# EAGLE design Gripper Control Board (EAGLE 9.6.2)
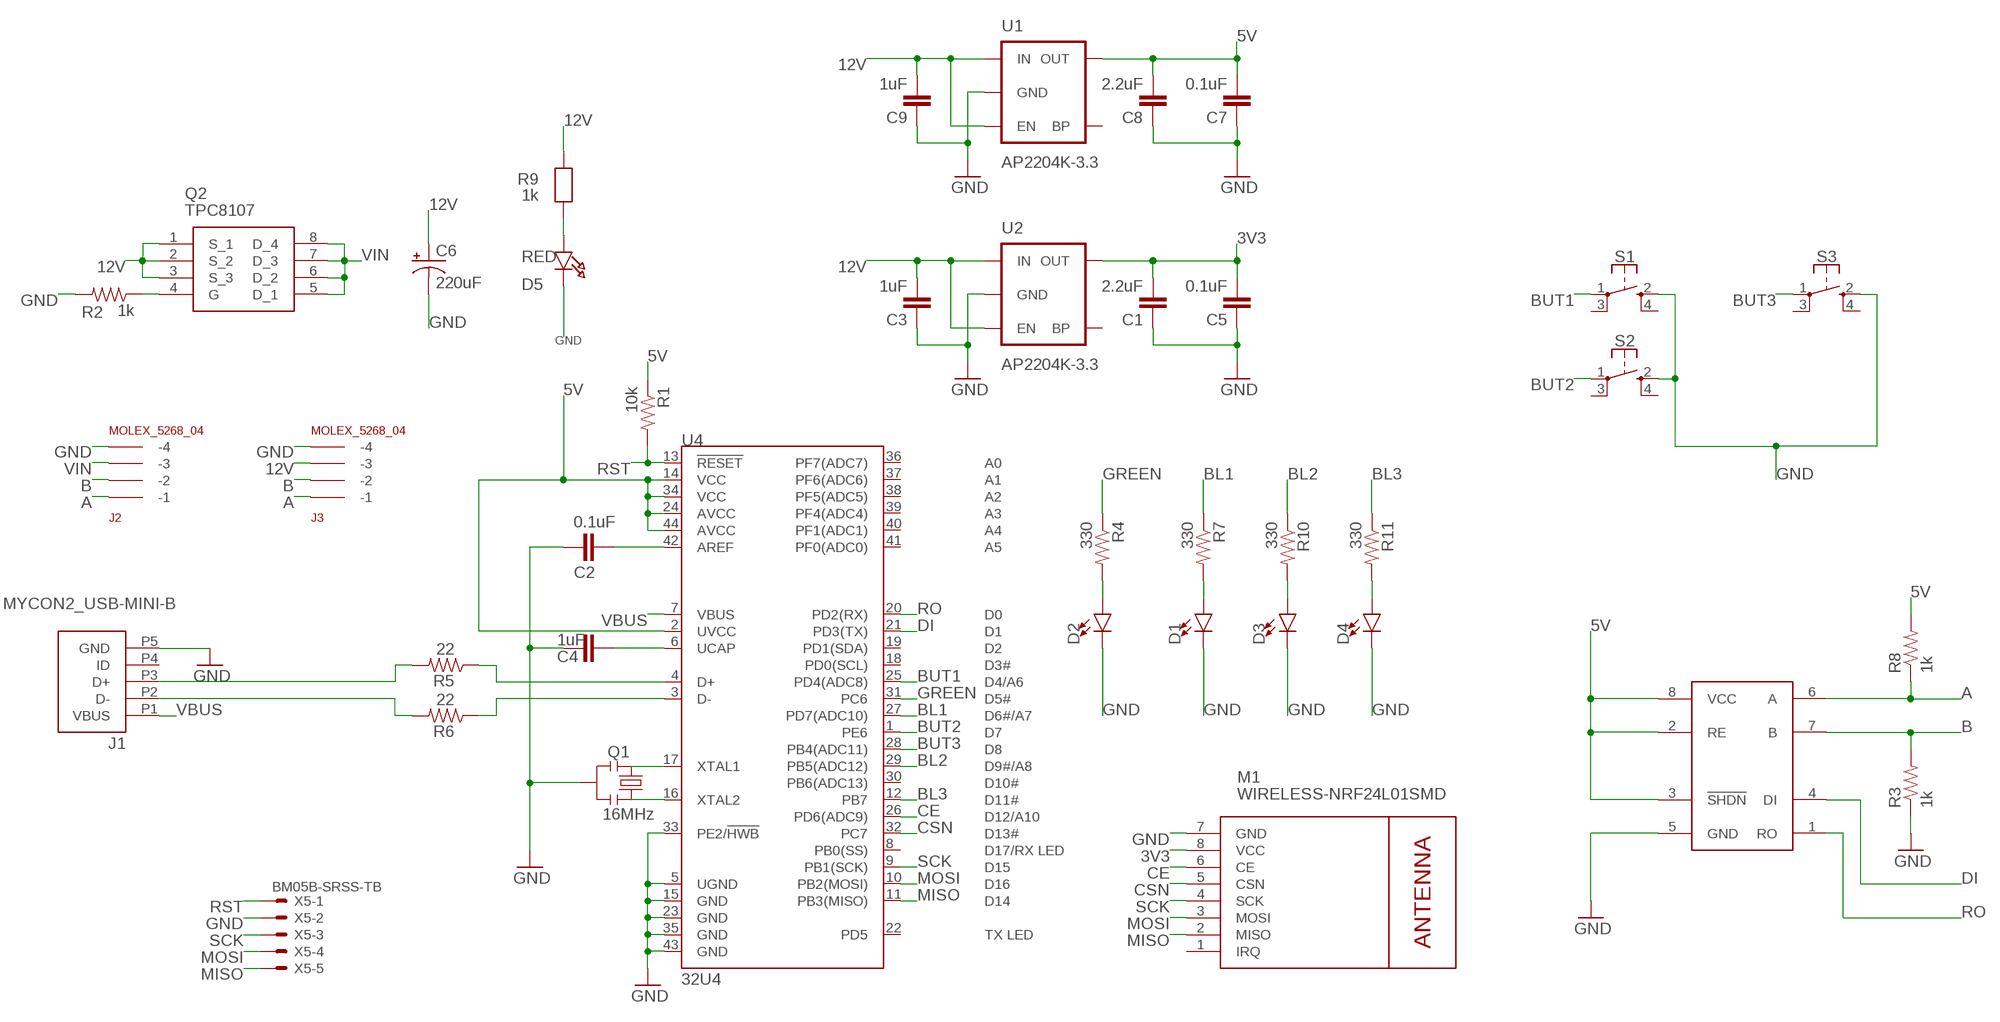
[diagram p0: schematic, sheet 1]

## Parts
C1  2.2uF  CAP0603-CAP  [0603-CAP]
C2  0.1uF  CAP0603-CAP  [0603-CAP]
C3  1uF  CAP0603-CAP  [0603-CAP]
C4  1uF  CAP0603-CAP  [0603-CAP]
C5  0.1uF  CAP0603-CAP  [0603-CAP]
C6  220uF  100UF-POLAR-25V-20%(ELEC)  [PANASONIC_D]
C7  0.1uF  CAP0603-CAP  [0603-CAP]
C8  2.2uF  CAP0603-CAP  [0603-CAP]
C9  1uF  CAP0603-CAP  [0603-CAP]
D1  LED0603  [LED-0603]
D2  LED0603  [LED-0603]
D3  LED0603  [LED-0603]
D4  LED0603  [LED-0603]
D5  RED  LED0603  [CHIPLED_0603]
J1  MYCON2_USB-MINI-B  [CON2_USB_MICRO_B_AT]
J2  MOLEX_5268_04  [5267-4]
J3  MOLEX_5268_04  [5267-4]
M1  WIRELESS-NRF24L01SMD  [WIRELESS-NRF24L01-SMD]
Q1  16MHz  RESONATORSMD  [RESONATOR-SMD]
Q2  TPC8107  [SOIC127P600X175-8N]
R1  10k  RESISTOR0603  [0603-RES]
R2  1k  1KOHM-0603-1/10W-1%  [0603]
R3  1k  RESISTOR0603-RES  [0603-RES]
R4  330  RESISTOR0603  [0603-RES]
R5  22  RESISTOR0603  [0603-RES]
R6  22  RESISTOR0603  [0603-RES]
R7  330  RESISTOR0603  [0603-RES]
R8  1k  RESISTOR0603-RES  [0603-RES]
R9  1k  RESISTOR0603MINI  [0603-MINI]
R10  330  RESISTOR0603  [0603-RES]
R11  330  RESISTOR0603  [0603-RES]
S1  SKSGAAE010  [SKSG]
S2  SKSGAAE010  [SKSG]
S3  SKSGAAE010  [SKSG]
U1  AP2204K-3.3  V_REG_LDOSMD  [SOT23-5]
U2  AP2204K-3.3  V_REG_LDOSMD  [SOT23-5]
U3  MAX13487  MAX13487SOIC  [MAX13487]
U4  32U4  ATMEGA32U4QFN2  [QFN-44-NOPAD]
X5  BM05B-SRSS-TB  [BM05B-SRSS-TB]

## Nets
3V3: C1.2 C5.2 M1.8(VCC) U2.5(OUT)
5V: C7.2 C8.2 R1.1 R8.2 U1.5(OUT) U3.2(RE) U3.3(!SHDN) U3.8(VCC) U4.2(UVCC) U4.14(VCC) U4.24(AVCC) U4.34(VCC) U4.44(AVCC)
12V: C3.2 C6.+ C9.2 J3.P$3(-3) Q2.1(S_1) Q2.2(S_2) Q2.3(S_3) R9.2 U1.1(IN) U1.3(EN) U2.1(IN) U2.3(EN)
A: J2.P$1(-1) J3.P$1(-1) R8.1 U3.6(A)
B: J2.P$2(-2) J3.P$2(-2) R3.2 U3.7(B)
BL1: R7.1 U4.27(PD7(ADC10))
BL2: R10.1 U4.29(PB5(ADC12))
BL3: R11.1 U4.12(PB7)
BUT1: S1.1 U4.25(PD4(ADC8))
BUT2: S2.1 U4.1(PE6)
BUT3: S3.1 U4.28(PB4(ADC11))
CE: M1.6(CE) U4.26(PD6(ADC9))
CSN: M1.5(CSN) U4.32(PC7)
D1_N: J1.P2(D-) R6.2
D1_P: J1.P3(D+) R5.2
D2_N: R6.1 U4.3(D-)
D2_P: R5.1 U4.4(D+)
DI: U3.4(DI) U4.21(PD3(TX))
GND: C1.1 C2.1 C3.1 C4.1 C5.1 C6.- C7.1 C8.1 C9.1 D1.C D2.C D3.C D4.C D5.C J1.P5(GND) J2.P$4(-4) J3.P$4(-4) M1.7(GND) Q1.2 R2.2 R3.1 S1.2 S2.2 S3.2 U1.2(GND) U2.2(GND) U3.5(GND) U4.5(UGND) U4.15(GND) U4.23(GND) U4.33(PE2/!HWB) U4.35(GND) U4.43(GND) X5.2
GREEN: R4.1 U4.31(PC6)
MISO: M1.2(MISO) U4.11(PB3(MISO)) X5.5
MOSI: M1.3(MOSI) U4.10(PB2(MOSI)) X5.4
N$1: D2.A R4.2
N$2: D1.A R7.2
N$3: D3.A R10.2
N$4: D4.A R11.2
N$6: D5.A R9.1
N$7: Q2.4(G) R2.1
N$37: C4.2 U4.6(UCAP)
N$39: C2.2 U4.42(AREF)
RO: U3.1(RO) U4.20(PD2(RX))
RST: R1.2 U4.13(!RESET) X5.1
SCK: M1.4(SCK) U4.9(PB1(SCK)) X5.3
VBUS: J1.P1(VBUS) U4.7(VBUS)
VIN: J2.P$3(-3) Q2.5(D_1) Q2.6(D_2) Q2.7(D_3) Q2.8(D_4)
X1: Q1.1 U4.17(XTAL1)
X2: Q1.3 U4.16(XTAL2)
Unconnected: J1.P4(ID) M1.1(IRQ) S1.3 S1.4 S2.3 S2.4 S3.3 S3.4 U1.4(BP) U2.4(BP) U4.8(PB0(SS)) U4.18(PD0(SCL)) U4.19(PD1(SDA)) U4.22(PD5) U4.30(PB6(ADC13)) U4.36(PF7(ADC7)) U4.37(PF6(ADC6)) U4.38(PF5(ADC5)) U4.39(PF4(ADC4)) U4.40(PF1(ADC1)) U4.41(PF0(ADC0))

## Library data of the parts
C1-C5 C7-C9 = SparkFun-Passives:CAP: Capacitor Standard 0603 ceramic capacitor, and 0.1" leaded capacitor.; PROD_ID: CAP-00868
C6 = SparkFun-Capacitors:100UF-POLAR: 100µF polarized capacitors A capacitor is a passive two-terminal electrical component used to store electrical energy temporarily in an electric field.; PROD_ID: CAP-12547; VALUE: 100uF
D1-D4 = SparkFun-LED:LED: LED (Generic) Standard schematic elements and footprints for 5mm, 3mm, 1206, and 0603 sized LEDs. Generic LEDs with no color specified.
D5 = microbuilder:LED: LED 0603 - 0603 Surface Mount Package 2mA: Green LED - Low Power (3.9mcd, 2ma, 1.7Vf) - Digikey: 475-2709-2-ND Orange LED - Low Power (9.8mcd, 2ma, 1.8Vf) - Digikey: 475-1194-2-ND Red LED - Low Power (5mcd, 2ma, 1.8Vf) - Digikey: 475-1195-2-ND Yellow LED - Low Power (7mcd, 2ma, 1.8Vf) - Digikey: 475-1196-2-ND 5mA: Blue LED - Low Power (17mcd, 5ma, 2.9Vf) - Digikey: LNJ937W8CRACT-ND 0805 - 0805 Surface Mount Package 2mA: Red LED (8.8mcd, 2mA, 1.8Vf, Clear) - Low Power [Digikey: 475-2510-1-ND] Green LED (5mcd, 2mA, 1.8Vf, Clear) - Low Power [Digikey: 475-2730-1-ND] Yellow LED (11.3mcd, 2mA, 1.8Vf, Clear) - Low Power [Digikey: 475-2555-1-ND] 20mA: Red LED (104mcd, 20mA, Diffused) - LS R976 [Digikey: 475-1278-6-ND] Red LED (12mcd, 20mA, 2.0Vf, Clear) - APT2012EC [Digikey: 754-1128-1-ND] Green LED (15mcd, 20mA, 2.2Vf, Clear) - APT2012GC [Digikey: 754-1131-1-ND] Orange LED (160mcd, 20mA, 2.1Vf, Clear) - APT2012SECK [Digikey: 754-1130-1-ND] 1206 - 1206 Surface Mount Package Green LED (26mcd, 20mA, Diffused) - LG N971 [Digikey: 475-1407-6-ND] Red LED (15mcd, 20mA, Diffused) - LH N974 [Digikey: 475-1416-6-ND]
J1 = SmartPrj:MYCON2_USB-MINI-B
J2 J3 = customCON:MOLEX_5268_04
M1 = 1459411900832-nrf24l01plus:WIRELESS-NRF24L01: 2.4 GHz Wireless Module based on NRF24L01 chip
Q1 = Testing:RESONATOR: Resonator Small SMD resonator. This is the itty bitty 10/20MHz resonators with built in caps. CSTCE10M0G55 and CSTCE20M0V53. Footprint for SMD has been used in SFE production for years, and does work okay. 1:1 is an attempt to get larger fillets on the sides so it will be easier to inspect these solders in our AOI machine. The pads have been minimized to match the actual metal under the resonator. To see this relation, it includes an image import of the bottom side of the component. Imported to scale on layer 200.
Q2 = TPC8107:TPC8107: MOSFET P-Channel 30V 12A 8-Pin SOIC TPC8107; ALLIED_NUMBER: 70438040; ALLIED_PRICE-STOCK: https://www.alliedelec.com/diodes-inc-dmg4413lss-13/70438040/; DESCRIPTION: MOSFET P-Channel 30V 12A SOIC8PEP Diodes Inc DMG4413LSS-13 P-channel MOSFET Transistor, 12 A, 30 V, 8-Pin SOIC; HEIGHT: 1.75mm; MANUFACTURER_NAME: Diodes Inc.; MANUFACTURER_PART_NUMBER: DMG4413LSS-13; MOUSER_PART_NUMBER: 621-DMG4413LSS-13; MOUSER_PRICE-STOCK: https://www.mouser.com/Search/Refine.aspx?Keyword=621-DMG4413LSS-13; RS_PART_NUMBER: 7514102P; RS_PRICE-STOCK: http://uk.rs-online.com/web/p/products/7514102P
R1 R4 R6 R10 R11 = SparkFun-Resistors:RESISTOR: Resistor Basic schematic elements and footprints for 0603, 1206, and PTH resistors.; PROD_ID: RES-08698
R2 = SparkFun-Resistors:1KOHM: 1kΩ resistor A resistor is a passive two-terminal electrical component that implements electrical resistance as a circuit element. Resistors act to reduce current flow, and, at the same time, act to lower voltage levels within circuits. - Wikipedia; PROD_ID: RES-07856
R3 R8 = SparkFun-Passives:RESISTOR: Resistor Basic schematic elements and footprints for 0603, 1206, and PTH resistors.
R5 R7 = SparkFun-Resistors:RESISTOR: Resistor Basic schematic elements and footprints for 0603, 1206, and PTH resistors.; PROD_ID: RES-08698; SPICEPREFIX: R
R9 = microbuilder:RESISTOR: Resistors 0402 - 0402 Surface Mount Package 22 Ohm 1% 1/16W [Digikey: 311-22.0LRTR-ND] 33 Ohm 5% 1/16W 1.0K 5% 1/16W 1.5K 5% 1/16W 2.0K 1% 1/16W 10.0K 1% 1/16W [Digikey: 311-10.0KLRTR-ND] 10.0K 5% 1/16W [Digikey: RMCF0402JT10K0TR-ND] 12.1K 1% 1/16W [Digikey: 311-22.0LRTR-ND] 100.0K 5% 1/16W 0603 - 0603 Surface Mount Package 0 Ohm 1/10 Watt 1% Resistor 15 Ohm 1/10 Watt 1% Resistor 33 Ohm 1/10 Watt 1% Resistor 49.9 Ohm 1/10 Watt 1% Resistor 100 Ohm 1/10 Watt 1% Resistor 150 Ohm 1/10 Watt 1% Resistor 240 Ohm 1/10 Watt 1% Resistor 390 Ohm 1/10 Watt 1% Resistor 560 Ohm 1/10 Watt 1% Resistor 680 Ohm 1/10 Watt 1% Resistor 750 Ohm 1/10 Watt 1% Resistor 1.0K Ohm 1/10 Watt 1% Resistor 1.5K Ohm 1/10 Watt 1% Resistor 2.0K Ohm 1/10 Watt 1% Resistor 2.2K Ohm 1/10 Watt 1% Resistor 3.3K Ohm 1/10 Watt 1% Resistor 4.7K Ohm 1/10 Watt 1% Resistor 10.0K Ohm 1/10 Watt 1% Resistor 12.0K Ohm 1/10 Watt 1% Resistor 12.1K Ohm 1/10 Watt 1% Resistor 20.0K Ohm 1/10 Watt 1% Resistor 33.0K Ohm 1/10 Watt 1% Resistor 100.0K Ohm 1/10 Watt 1% Resistor 0805 - 0805 Surface Mount Package 0 Ohm 1/8 Watt 1% Resistor 33 Ohm 1/8 Watt 1% Resistor 100 Ohm 1/8 Watt 1% Resistor 150 Ohm 1/8 Watt 1% Resistor 200 Ohm 1/8 Watt 1% Resistor 240 Ohm 1/8 Watt 1% Resistor 330 Ohm 1/8 Watt 1% Resistor 390 Ohm 1/8 Watt 1% Resistor 470 Ohm 1/8 Watt 1% Resistor 1.0K Ohm 1/8 Watt 1% Resistor 1.5K Ohm 1/8 Watt 1% Resistor 2.0K Ohm 1/8 Watt 1% Resistor 4.7K Ohm 1/8 Watt 1% Resistor 5.1K Ohm 1/8 Watt 1% Resistor 5.6K Ohm 1/8 Watt 1% Resistor 10.0K Ohm 1/8 Watt 1% Resistor 22.0K Ohm 1/8 Watt 1% Resistor 33.0K Ohm 1/8 Watt 1% Resistor 100K Ohm 1/8 Watt 1% Resistor 1206 - 1206 Surface Mount Package 2012 - 2010 Surface Mount Package 0.11 Ohm 1/2 Watt 1% Resistor - Digikey: RHM.11UCT-ND
S1-S3 = SKSGAAE010:SKSGAAE010: Black Button Tactile Switch, SPST-NO 50 mA 0.4mm Surface Mount Source: Datasheet <http://uk.rs-online.com/web/p/products/9173829>; DESCRIPTION: Black Button Tactile Switch, SPST-NO 50 mA 0.4mm Surface Mount; HEIGHT: mm; MANUFACTURER_NAME: ALPS; MANUFACTURER_PART_NUMBER: SKSGAAE010; MOUSER_PART_NUMBER: 688-SKSGAAE010; MOUSER_PRICE-STOCK: https://www.mouser.com/Search/Refine.aspx?Keyword=688-SKSGAAE010
U1 U2 = SparkFun:V_REG_LDO: Voltage Regulator LDO Standard 150mA LDO voltage regulator in SOT-23 layout. Micrel part MIC5205. BP (by-pass) pin is used to lower output noise with 470pF cap.
U3 = AET:MAX13487
U4 = SparkFun-IC-Microcontroller:ATMEGA32U4: Atmel MCU, 32KByte Atmel 44-pin 8-bit Microcontroller with 32KBytes of ISP Flash and USB Controller Datasheet <http://cdn.sparkfun.com/datasheets/Dev/Arduino/Boards/ATMega32U4.pdf> SparkFun Products LilyPad Arduino USB - ATmega32U4 Board <https://www.sparkfun.com/products/12049> (DEV-12049) Pro Micro - 5V/16MHz <https://www.sparkfun.com/products/12640> (DEV-12640) Pro Micro - 3.3V/8MHz <https://www.sparkfun.com/products/12587> (DEV-12587) Fio v3 - ATmega32U4 <https://www.sparkfun.com/products/11520> (DEV-11520) Qduino Mini <https://www.sparkfun.com/products/13614> (DEV-13614) Makey Makey - Standard Kit <https://www.sparkfun.com/products/11511> (WIG-11511) Makey Makey Deluxe Kit <https://www.sparkfun.com/products/11519> (WIG-11519); PROD_ID: IC-10828
X5 = con-jst2:?M05B-SRSS-TB: Disconnectable Crimp style connector, 1.0mm pitch 5 contacts

## Net classes
0 SIG: width 0.152 mm, drill 0.3 mm, clearance 0.152 mm

## Board
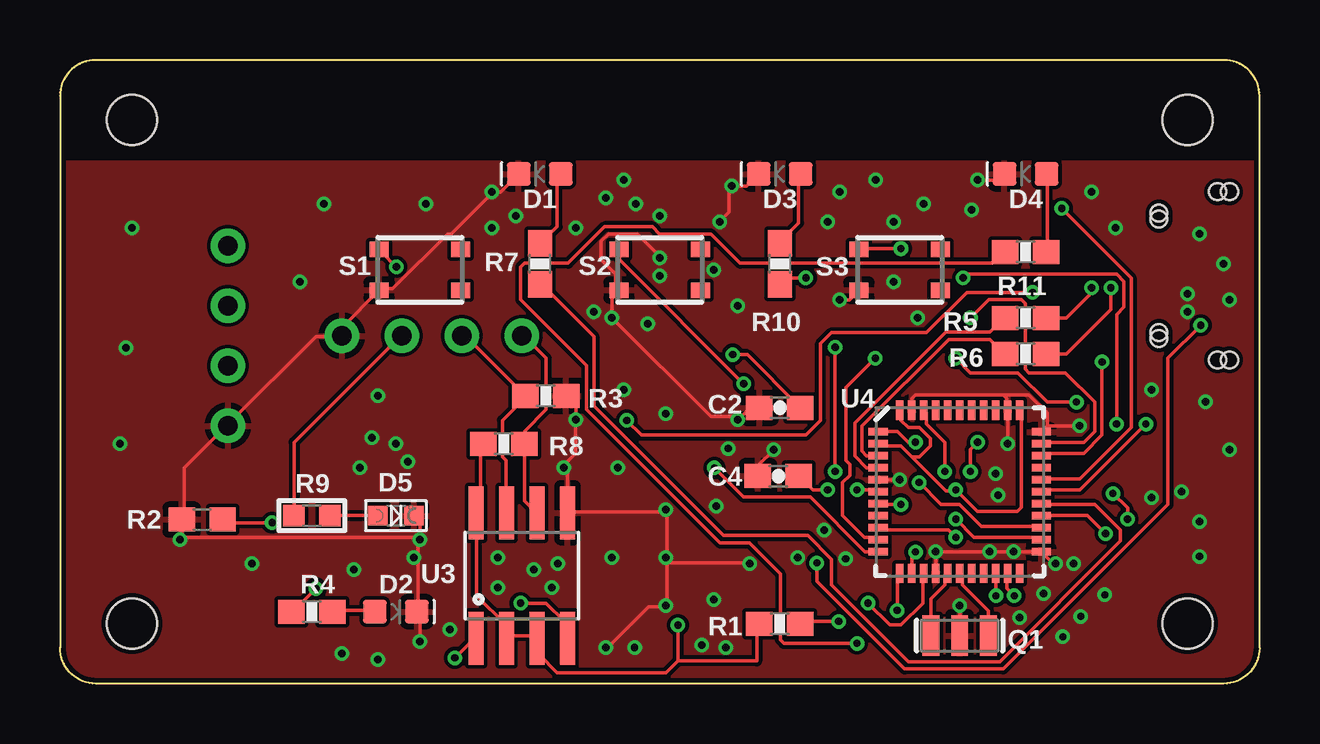
[diagram p1: board, top side]
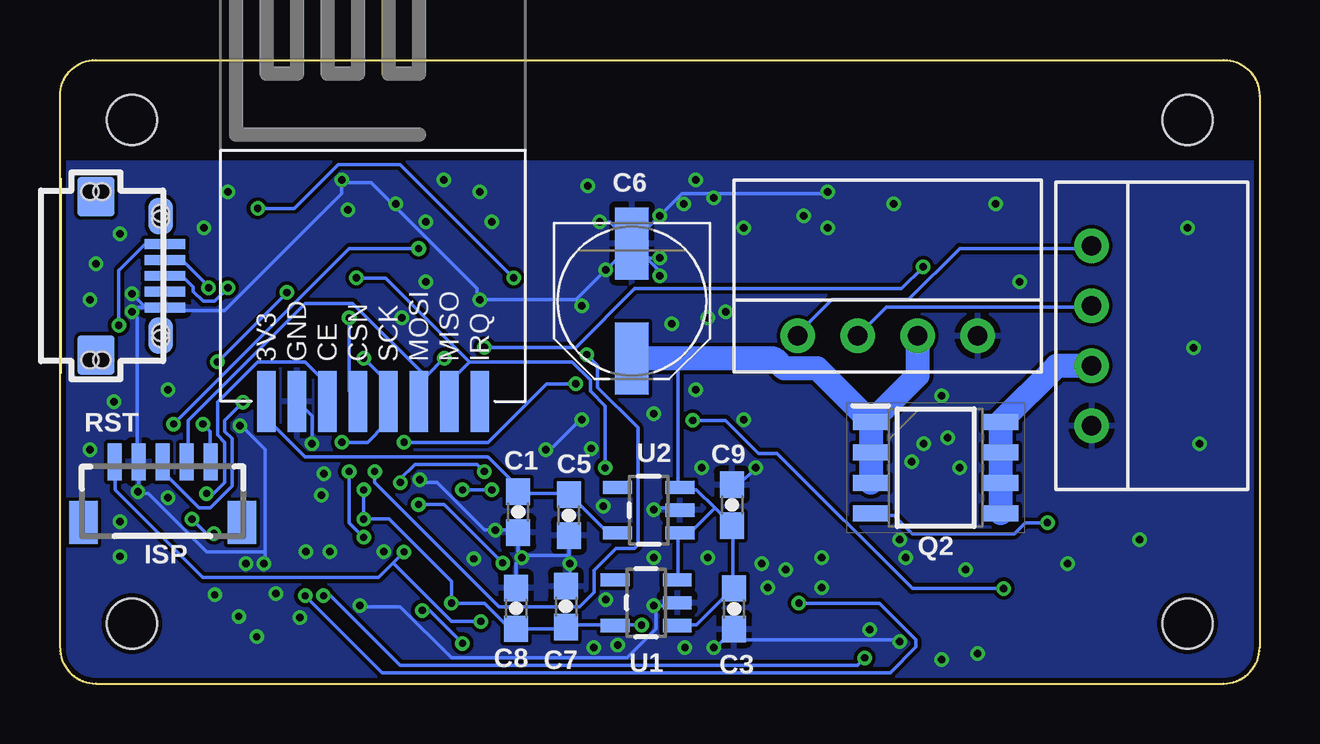
[diagram p2: board, bottom side, seen from below]

Size 50 x 26 mm. Coordinates in mm from the lower left corner, seen from the top.
Outline: 50,1.5 50,24.5 arc90 48.5,26 1.5,26 arc90 0,24.5 0,1.5 arc90 1.5,0 48.5,0 arc90 50,1.5
Copper layers (1*16): Top 0.035mm / dielectric 0.95mm / Bottom 0.035mm
Design rules "default *": minimum track width 6mil, minimum drill 0.3mm, track to track 6mil, track to pad 6mil, pad to pad 6mil, via to via 6mil, smd to smd 0mil, copper to edge 8mil, drill to drill 10mil, minimum pad ring 6mil, minimum via ring 6mil, stop-mask expansion 4mil, vias tented up to drill 0.3mm, thermal gap 10mil
Holes 2.1 mm at 3,23.5 47,23.5 3,2.5 47,2.5

### Footprints (pad centres in the part's own frame; a part is rotated, then mirrored left to right if it is on the bottom)
0603-CAP = smd 1.1 x 1: 1 -0.85,0; 2 0.85,0
PANASONIC_D = smd 3 x 1.4: + 2.4,0; - -2.4,0
LED-0603 = smd 1 x 1: A -0.877,0; C 0.877,0
CHIPLED_0603 = smd 0.8 x 0.8: A 0,-0.75; C 0,0.75
CON2_USB_MICRO_B_AT = smd 0.406 x 1.727: P1 -1.321,2.87; P2 -0.66,2.87; P3 0,2.87; P4 0.66,2.87; P5 1.321,2.87 | smd 1.651 x 1.549: S1 -3.302,0; S2 3.302,0 | smd 1.524 x 1.016: S3 -2.489,2.692; S4 2.489,2.692 | hole 0.7: -3.505,0.254; -3.505,-0.254; 3.505,0.254; 3.505,-0.254; -2.616,2.692; -2.362,2.692; 2.362,2.692; 2.616,2.692
5267-4 = drill 0.8 pad 1.422: P$1 -3.75,-2.5; P$2 -1.25,-2.5; P$3 1.25,-2.5; P$4 3.75,-2.5
WIRELESS-NRF24L01-SMD = smd 2.54 x 0.762: 1 1.27,0; 2 1.27,1.27; 3 1.27,2.54; 4 1.27,3.81; 5 1.27,5.08; 6 1.27,6.35; 7 1.27,7.62; 8 1.27,8.89
RESONATOR-SMD = smd 0.7 x 1.7: 1 -1.2,0; 2 0,0; 3 1.2,0
SOIC127P600X175-8N = smd 1.5 x 0.65: 1 -2.7,1.905; 2 -2.7,0.635; 3 -2.7,-0.635; 4 -2.7,-1.905; 5 2.7,-1.905; 6 2.7,-0.635; 7 2.7,0.635; 8 2.7,1.905
0603-RES = smd 1.1 x 1: 1 -0.85,0; 2 0.85,0
0603 = smd 1.1 x 1: 1 -0.85,0; 2 0.85,0
0603-MINI = smd 0.9 x 0.9: 1 -0.75,0; 2 0.75,0
SKSG = smd 0.8 x 0.65: 1 -1.7,0.85; 2 -1.7,-0.85; 3 1.7,0.85; 4 1.7,-0.85
SOT23-5 = smd 0.55 x 1.2: 1 -0.95,-1.3; 2 0,-1.3; 3 0.95,-1.3; 4 0.95,1.3; 5 -0.95,1.3
MAX13487 = smd 0.61 x 2.21: 1 -1.905,-2.616; 2 -0.635,-2.616; 3 0.635,-2.616; 4 1.905,-2.616; 5 1.905,2.616; 6 0.635,2.616; 7 -0.635,2.616; 8 -1.905,2.616
QFN-44-NOPAD = smd 0.8 x 0.3: 1 -3.4,2.5; 2 -3.4,2; 3 -3.4,1.5; 4 -3.4,1; 5 -3.4,0.5; 6 -3.4,0; 7 -3.4,-0.5; 8 -3.4,-1; 9 -3.4,-1.5; 10 -3.4,-2; 11 -3.4,-2.5; 23 3.4,-2.5; 24 3.4,-2; 25 3.4,-1.5; 26 3.4,-1; 27 3.4,-0.5; 28 3.4,0; 29 3.4,0.5; 30 3.4,1; 31 3.4,1.5; 32 3.4,2; 33 3.4,2.5 | smd 0.3 x 0.8: 12 -2.5,-3.4; 13 -2,-3.4; 14 -1.5,-3.4; 15 -1,-3.4; 16 -0.5,-3.4; 17 0,-3.4; 18 0.5,-3.4; 19 1,-3.4; 20 1.5,-3.4; 21 2,-3.4; 22 2.5,-3.4; 34 2.5,3.4; 35 2,3.4; 36 1.5,3.4; 37 1,3.4; 38 0.5,3.4; 39 0,3.4; 40 -0.5,3.4; 41 -1,3.4; 42 -1.5,3.4; 43 -2,3.4; 44 -2.5,3.4
BM05B-SRSS-TB = smd 0.6 x 1.55: 1 2,-1.625; 2 1,-1.625; 3 0,-1.625; 4 -1,-1.625; 5 -2,-1.625 | smd 1.2 x 1.8: FIT@1 3.3,0.9; FIT@2 -3.3,0.9

### Placement (x,y rotation side)
C1  30.9,7.15 90 bottom
C2  30,11.5 0 top
C3  21.9,3.12 90 bottom
C4  29.94,8.65 0 top
C5  28.79,7.02 90 bottom
C6  26.16,15.95 270 bottom
C7  28.91,3.21 270 bottom
C8  30.99,3.13 270 bottom
C9  21.99,7.44 270 bottom
D1  20,21.25 180 top
D2  14,3 0 top
D3  30,21.25 180 top
D4  40.25,21.25 180 top
D5  14,7 270 top
J1  48.5,17 270 bottom
J2  4.5,14.5 270 bottom
J3  15.5,17 0 bottom
M1  32.5,10.5 90 bottom
Q1  37.5,2 180 top
Q2  13.5,9 0 bottom
R1  30,2.5 0 top
R2  5.93,6.84 180 top
R3  20.25,12 180 top
R4  10.5,3 0 top
R5  40.25,15.25 0 top
R6  40.25,13.75 0 top
R7  20,17.5 90 top
R8  18.5,10 180 top
R9  10.5,7 180 top
R10  30,17.5 90 top
R11  40.25,18 0 top
S1  15,17.25 0 top
S2  25,17.25 0 top
S3  35,17.25 0 top
U1  25.57,3.37 90 bottom
U2  25.46,7.23 90 bottom
U3  19.25,4.5 0 top
U4  37.5,8 0 top
X5  45.72,7.62 180 bottom

### Tracks (layer width: path | path; a pad name or v marks a point on that pad's centre or on a via)
3V3
  Bottom 0.152: U2.5 26.82,6.4 27.28,6.4 28.65,7.77 C5.2 28.8,7.92 30.79,7.92 C1.2 30.79,8.08 32.16,9.45 39.78,9.45 41.3,10.97 41.3,11.73 M1.8
5V  (via drill 0.3)
  Top 0.152: R8.2 17.53,9.91 17.53,7.32 17.37,7.16 U3.8 17.37,7.01 17.37,3.66 18.59,2.44 18.59,1.98 U3.2 18.75,1.98 19.81,1.98 U3.3 19.96,1.83 19.96,1.22 20.73,0.46 25.25,0.46 25.76,0.96 v25.76,2.44 25.76,0.94 29.05,0.94 29.05,2.4 R1.1 | 35.51,9.45 35.05,9.91 34.14,9.91 U4.2 | 35.51,9.45 35.81,9.45 36.27,9.91 36.27,10.21 35.81,10.67 35.36,10.67 35.05,10.97 35.05,11.28 U4.44 | 35.51,9.45 36.93,8.03 37.29,8.03 v37.34,8.08 38.24,7.18 39.91,7.18 40.08,7.35 40.08,11.28 U4.34 | v33.68,3.35 34.59,2.44 35.05,2.44 35.97,3.35 35.97,4.57 U4.14 | v37.34,6.86 38.1,6.1 40.84,6.1 U4.24
  Bottom 0.152: v37.34,8.08 v37.34,6.86 36.27,6.86 33.68,4.27 v33.68,3.35 32.31,3.35 31.09,2.13 C8.2 30.94,2.29 28.96,2.29 C7.2 28.8,2.44 26.98,2.44 U1.5 26.82,2.44 v25.76,2.44
12V
  Top 0.152: R9.2 9.75,10.06 14.17,14.48 J3.P$3
  Bottom 0.152: U1.3 24.23,4.42 24.23,6.25 U2.1 24.08,6.4 23.62,6.4 22.71,7.32 | 22.71,7.32 22.1,6.71 C9.2 21.95,6.55 21.95,4.12 C3.2 21.95,3.96 23.47,2.44 24.23,2.44 U1.1 | 22.71,7.32 23.47,8.08 24.08,8.08 U2.3 24.23,8.23 24.23,13.54
  Bottom 1: Q2.1 14.25,12.86 J3.P$3 | Q2.1 Q2.2 Q2.3 | C6.+ 24.23,13.54 20.22,13.54 19.82,13.14 18.43,13.14 Q2.1
A
  Top 0.152: U3.6 19.81,7.16 19.36,7.62 19.36,9.91 R8.1 19.36,10.06 19.36,10.52 20.27,11.43 20.27,13.56 19.36,14.48 J3.P$1
  Bottom 0.152: J2.P$1 7.01,18.14 12.5,18.14 14.63,16 17.83,16 19.2,14.63 J3.P$1
B
  Top 0.152: J3.P$2 16.76,14.63 19.36,12.04 R3.2 19.36,11.89 18.44,10.97 18.44,9.45 18.59,9.3 18.59,7.16 U3.7
  Bottom 0.152: J2.P$2 7.01,15.7 15.54,15.7 16.61,14.63 J3.P$2
BL1
  Top 0.152: U4.27 41,7.47 43.13,7.47 44.2,6.4 44.2,5.94 39.17,0.91 35.36,0.91 32.16,4.12 32.16,5.18 31.17,6.17 27.66,6.17 22.25,11.58 22.25,14.48 20.12,16.61 R7.1
BL2  (via drill 0.3)
  Top 0.152: v41.76,19.81 44.65,16.92 44.65,10.67 42.52,8.53 41,8.53 U4.29 | v31.09,16.92 30.18,16.92 30.02,16.76 R10.1
  Bottom 0.152: v41.76,19.81 40.23,19.81 38.41,21.64 35.81,21.64 v31.09,16.92
BL3  (via drill 0.3)
  Top 0.152: v34.9,3.05 34.9,4.57 U4.12 | v33.22,1.68 30.18,1.68 30.02,1.83 30.02,4.57 28.73,5.86 27.51,5.86 21.95,11.43 21.95,13.26 19.2,16 19.2,17.37 19.36,17.53 21.18,17.53 22.71,19.05 24.69,19.05 24.99,18.75 27.13,18.75 28.35,17.53 38.86,17.53 39.32,17.98 R11.1
  Bottom 0.152: v34.9,3.05 34.59,3.05 v33.22,1.68
BUT1  (via drill 0.3)
  Top 0.152: v35.81,8.38 36.73,7.47 37.49,7.47 38.41,6.55 40.84,6.55 U4.25 | v32.31,14.02 v32.31,8.84 | v14.02,17.37 13.41,17.98 S1.1
  Bottom 0.152: v35.81,8.38 35.81,8.53 35.2,9.14 32.61,9.14 v32.31,8.84 | v32.31,14.02 28.5,14.02 26.06,16.46 14.94,16.46 v14.02,17.37
BUT2  (via drill 0.3)
  Top 0.152: v28.5,12.5 23.32,17.68 23.32,17.98 S2.1 | v35.66,10.06 35.36,10.06 34.9,10.52 34.14,10.52 U4.1
  Bottom 0.152: v28.5,12.5 29.72,12.5 32.16,10.06 v35.66,10.06
BUT3  (via drill 0.3)
  Top 0.152: v45.26,10.82 42.52,8.08 41,8.08 U4.28 | v35.05,18.14 33.38,18.14 S3.1
  Bottom 0.152: v45.26,10.82 37.95,18.14 v35.05,18.14
CE  (via drill 0.3)
  Top 0.152: v43.59,6.25 42.82,7.01 41,7.01 U4.26 | v44.5,6.86 44.5,7.32 v43.89,7.92
  Bottom 0.152: v43.59,6.25 43.89,6.25 v44.5,6.86 | v43.89,7.92 43.59,7.92 43.13,8.38 43.13,10.06 43.43,10.36 43.43,11.73 41.76,13.41 39.78,13.41 38.86,12.5 38.86,11.89 M1.6
CSN  (via drill 0.3)
  Top 0.152: v37.95,15.24 38.71,16 40.08,16 40.23,15.85 40.23,13.11 40.39,12.95 41.91,12.95 43.13,11.73 43.13,10.52 42.67,10.06 41,10.06 U4.32
  Bottom 0.152: v37.95,15.24 37.95,12.19 37.64,11.89 M1.5
D1_N  (via drill 0.3)
  Top 0.152: R6.2 41.95,13.75 43.81,15.6 v43.81,16.5
  Bottom 0.152: J1.P2 44.91,17.66 43.81,16.56 v43.81,16.5
D1_P  (via drill 0.3)
  Top 0.152: R5.2 41.95,15.25 43,16.3 v43,16.5
  Bottom 0.152: J1.P3 44.91,17 44.44,16.53 44.44,16.35 44.04,15.94 43.56,15.94 v43,16.5
D2_N
  Top 0.152: U4.3 33.62,9.5 33.43,9.69 33.43,10.73 37.05,14.35 38.75,14.35 39.35,13.75 R6.1
D2_P
  Top 0.152: U4.4 33.62,9 33.13,9.49 33.13,10.86 36.92,14.65 38.75,14.65 39.35,15.25 R5.1
DI  (via drill 0.3)
  Top 0.152: v39.78,3.66 39.47,3.96 39.47,4.57 U4.21 | v19.2,3.35 20.27,3.35 21.03,2.59 21.03,1.98 U3.4
  Bottom 0.152: v39.78,3.66 36.58,0.46 15.39,0.46 14.33,1.52 14.33,1.83 15.85,3.35 v19.2,3.35
GND  (via drill 0.3)
  Top 0.152: D1.C 18.37,20.5 v18,20.5 17.98,20.42 16.31,18.75 16.15,18.75 13.87,16.46 13.41,16.46 S1.2 11.75,14.85 J3.P$4 11.73,14.48 10.67,14.48 7.01,10.82 J2.P$4 6.86,10.67 5.18,8.99 5.18,6.86 R2.2 5.08,6.08 v5,6 5.03,6.1 14.94,6.1 v15,6 | C2.1 28.75,11.5 v28.25,11 28.19,11.12 27.13,11.12 23.01,15.24 v23,15.25 23,16.1 S2.2 23.16,16.46 23.16,17.07 22.55,17.68 22.55,18.44 22.86,18.75 24.08,18.75 24.99,17.83 v25,17.75 | Q1.2 v37.5,3.25 | U4.15 v36.5,5.5 36.58,5.49 40.84,5.49 U4.23 41.4,5 v41.5,5 | U4.5 v35,8.5 | v39.5,10 U4.35 39.47,11.43 39.47,11.89 39.32,12.04 | U4.33 41.15,10.75 | 41.15,10.75 v42.5,10.75 | D4.C 39.12,21 v38.25,21 | S3.2 32.9,16 v32.5,16 | D3.C 28.62,20.75 v28,20.75 27.89,20.73 27.89,19.66 27.58,19.36 v27.5,19.25 | v15,1.75 15,2.88 D2.C 14.94,3.05 14.94,5.94 v15,6 | D5.C 15,6.75 v15,6 | R3.1 21.5,11.6 v21.5,11 21.49,10.97 21.49,9.6 21.03,9.14 v21,9 21.16,8.85 U3.5 21.18,7.16 25.15,7.16 v25.25,7.25 25.3,7.16 25.3,5.03 | C4.1 29.09,9.09 v29.75,9.75 | v22.75,1.5 22.86,1.52 24.54,3.2 25.15,3.2 v25.25,3.25 25.3,3.35 25.3,5.03 | 25.3,5.03 28.65,5.03 v28.75,5 | 39.32,12.04 35.66,12.04 35.51,11.89 35.51,11.43 U4.43 | 39.32,12.04 40.39,12.04 41.15,11.28 41.15,10.82 41.15,10.75
  Bottom 0.152: M1.7 39.5,11.15 v39.5,10 | J1.P5 46.82,15.68 v47,15.5 46.94,15.39 46.79,15.24 46.79,9.3 X5.2 46.72,8.03 v46.75,8 46.63,7.92 46.33,7.92 43.89,5.49 41.45,5.49 | J1.P5 46.43,15.68 v47,16.25 | v22.75,1.5 22.67,1.5 C3.1 21.79,2.13 21.49,1.83 15.09,1.83 v15,1.75 | U1.2 24.39,3.25 v25.25,3.25 25.15,3.2 25.15,2.29 26.36,1.07 33.68,1.07 35.81,3.2 37.49,3.2 v37.5,3.25 | C9.1 21.71,8.29 v21,9 | C7.1 28.75,4.22 v28.75,5 28.79,5.04 28.79,5.33 | C5.1 28.79,5.33 | v30.75,5.25 30.9,5.4 C1.1 30.94,6.4 32.31,6.4 34.29,8.38 34.9,8.38 v35,8.5 | C8.1 30.99,5.01 v30.75,5.25 | C6.- 25.57,17.75 v25,17.75 | C6.- 25,17.18 v25,17 | C6.- v27.25,17.25 27.28,17.22 28.5,16 32.46,16 v32.5,16 32.61,16 32.61,16.46 37.03,20.88 38.1,20.88 v38.25,21 38.25,20.88 38.25,20.42 43.13,15.54 45.57,15.54 J1.P5 | C6.- 27.07,19.25 v27.5,19.25 | C6.- v25,19.5 v24.99,19.51 24.08,20.42 18.14,20.42 v18,20.5 | 28.79,5.33 30.63,5.33 v30.75,5.25 | v25.25,7.25 25.15,7.32 24.23,7.32 U2.2 | 41.45,5.49 41.45,9.75 42.37,10.67 v42.5,10.75 | 41.45,5.49 41.45,5.03 v41.5,5 | v28.25,11 28.35,10.97 29.72,9.6 v29.75,9.75
  other vias: 2.5,10 2.75,14 3,19 11,20 15.25,20 10,16.75 13,10.25 12.5,9 14,10 8,5 11.75,1.25 20.75,5 18.25,5.25 18,19 23.5,21 22.75,20.25 24,20 24.5,15 23.5,12.25 23.25,9 23,5.25 18.25,4 16.25,2.25 12.25,4.75 13.25,1 27.25,3.5 25.25,11.25 28.25,15.75 32.5,20.5 38,19.75 36,20 43,20.5 48.5,17.5 48.75,16 47.5,18.75 47.75,11.75 48.75,9.75 45.5,12.25 47.5,5.3 42.55,2.8 41.8,1.95 41,3.75 40,2.75 42.25,5 39.75,5.5 38.75,5.5 43.55,3.7 47.5,6.75 44,19 35.75,15.25 34.75,16.75 25.25,5.25 13.25,12 21.5,19 19,19.5 19.75,4.75 20.5,4 14.75,5.25 14.5,9.25 22.25,15.5 32,19.25 34.75,19.25 34,21 45.5,7.75 39,8.75 32.75,5.2 27.35,7.4 27.85,9.8 31.85,6.4 39.1,7.85 26.75,1.6 27.75,1.5 23.95,1.5
  pour Top: -1,21.75 51,21.75 51,-1 -1,-1
  pour Bottom: -2,21.75 52,21.75 52,-2 -2,-2
GREEN  (via drill 0.3)
  Top 0.152: v43.43,13.41 43.43,10.36 42.67,9.6 41,9.6 U4.31 | v40.54,16.31 37.8,16.31 36.12,14.63 32.16,14.63 31.7,14.17 31.7,10.97 31.09,10.36 24.23,10.36 v23.62,10.97 | v10.67,3.96 9.75,3.05 R4.1
  Bottom 0.152: v40.54,16.31 v43.43,13.41 | v23.62,10.97 22.25,10.97 20.88,9.6 20.12,9.6 14.48,3.96 v10.67,3.96
MISO  (via drill 0.3)
  Top 0.152: U4.11 33.55,5.5 31.28,7.77 28.5,7.77 v27.28,8.99 | v44.04,10.82 44.04,15.39 44.35,15.7 44.35,16.76 44.04,17.07 37.8,17.07 v37.64,16.92
  Bottom 0.152: v27.28,8.99 27.28,11.58 27.89,12.19 27.89,12.65 28.65,13.41 32.92,13.41 | 32.92,13.41 33.68,12.65 33.68,11.89 M1.2 | v44.04,10.82 43.74,10.52 43.74,9.3 X5.5 | v37.64,16.92 36.42,16.92 32.92,13.41
MOSI  (via drill 0.3)
  Top 0.152: v33.98,13.56 32.77,12.34 32.77,9.3 32.92,9.14 32.92,8.69 32.61,8.38 32.61,7.01 33.53,6.1 33.98,6.1 U4.10
  Bottom 0.152: 34.75,12.8 34.9,12.65 34.9,11.89 M1.3 34.75,12.8 | 34.75,12.8 v33.98,13.56 | 34.75,12.8 37.8,15.85 39.78,15.85 44.65,10.97 44.65,9.3 X5.4
N$1
  Top 0.152: D2.A 13.11,3.05 11.43,3.05 R4.2
N$2
  Top 0.152: D1.A 20.73,21.18 20.73,19.05 20.12,18.44 R7.2
N$3
  Top 0.152: D3.A 30.79,21.18 30.79,19.2 30.02,18.44 R10.2
N$4
  Top 0.152: D4.A 41.15,21.18 41.15,18.14 R11.2
N$6
  Top 0.152: D5.A 13.11,7.01 11.28,7.01 R9.1
N$7  (via drill 0.3)
  Top 0.152: v8.84,6.71 6.86,6.71 R2.1
  Bottom 0.152: v8.84,6.71 9.75,6.71 10.21,6.25 14.48,6.25 15.24,7.01 16.15,7.01 Q2.4
N$37  (via drill 0.3)
  Top 0.152: v33.22,8.08 33.98,8.08 U4.6 | v32,8.08 31.39,8.08 30.94,8.53 C4.2
  Bottom 0.152: v32,8.08 v33.22,8.08
N$39  (via drill 0.3)
  Top 0.152: v36.88,8.84 36.88,10.06 36.12,10.82 36.12,11.28 U4.42 | v28.04,13.72 28.65,13.72 30.79,11.58 C2.2
  Bottom 0.152: v36.88,8.84 36.88,8.38 31.7,3.2 28.35,3.2 27.74,3.81 27.74,4.72 26.82,5.64 26.06,5.64 25.91,5.79 25.91,10.67 27.58,12.34 27.58,13.26 v28.04,13.72
RO  (via drill 0.3)
  Top 0.152: v39.01,3.66 39.01,4.57 U4.20 | v16.46,1.07 17.22,1.83 U3.1
  Bottom 0.152: v39.01,3.66 38.71,3.66 35.81,0.76 16.76,0.76 v16.46,1.07
RST  (via drill 0.3)
  Top 0.152: v35.66,5.49 35.51,5.33 35.51,4.72 U4.13 | v32.46,2.59 30.94,2.59 R1.2
  Bottom 0.152: 36.12,5.03 36.73,4.42 44.04,4.42 47.7,8.08 47.7,9.14 X5.1 | 36.12,5.03 v35.66,5.49 | v32.46,2.59 33.68,2.59 36.12,5.03
SCK  (via drill 0.3)
  Top 0.152: v37.34,6.1 37.03,6.4 34.14,6.4 U4.9 | v37.95,8.84 37.95,9.75 v38.25,10.06 | v42.37,11.73 41.15,11.73 39.93,12.95 37.95,12.95 v37.34,13.56
  Bottom 0.152: v37.34,6.1 37.95,6.71 v37.95,8.84 | v38.25,10.06 37.19,10.06 36.42,10.82 36.42,11.73 M1.4 36.42,11.89 36.42,12.65 v37.34,13.56 | X5.3 45.72,8.84 44.2,7.32 43.74,7.32 42.82,8.23 42.82,10.21 43.13,10.52 43.13,10.97 v42.37,11.73
VBUS  (via drill 0.3)
  Top 0.152: v35.05,7.47 34.14,7.47 U4.7 | v31.55,5.03 31.55,4.27 35.2,0.61 39.32,0.61 46.18,7.47 46.18,13.56 v47.55,14.94
  Bottom 0.152: v35.05,7.47 33.98,7.47 v31.55,5.03 | v47.55,14.94 47.55,17.22 46.48,18.29 45.72,18.29 J1.P1
VIN
  Bottom 1: J2.P$3 8.46,13.25 Q2.8 Q2.7 Q2.6 Q2.5
X1
  Top 0.152: U4.17 37.62,4.48 37.62,4.11 38.7,3.03 Q1.1
X2
  Top 0.152: U4.16 36.88,4.48 36.88,4.11 36.3,3.53 Q1.3

### Text on the board
bNames: RST | ISP